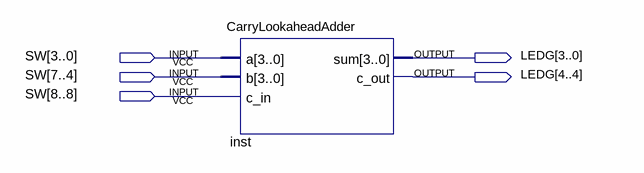
[diagram p0: schematic sheet]
// Quartus schematic block_carry_lookahead.bdf as structural Verilog: 1 symbols, 5 pins
module block_carry_lookahead (
  input  [8:0] SW,
  output [4:0] LEDG
);

  CarryLookaheadAdder inst (.a(SW[3:0]), .b(SW[7:4]), .c_in(SW[8]), .sum(LEDG[3:0]), .c_out(LEDG[4]));
endmodule
